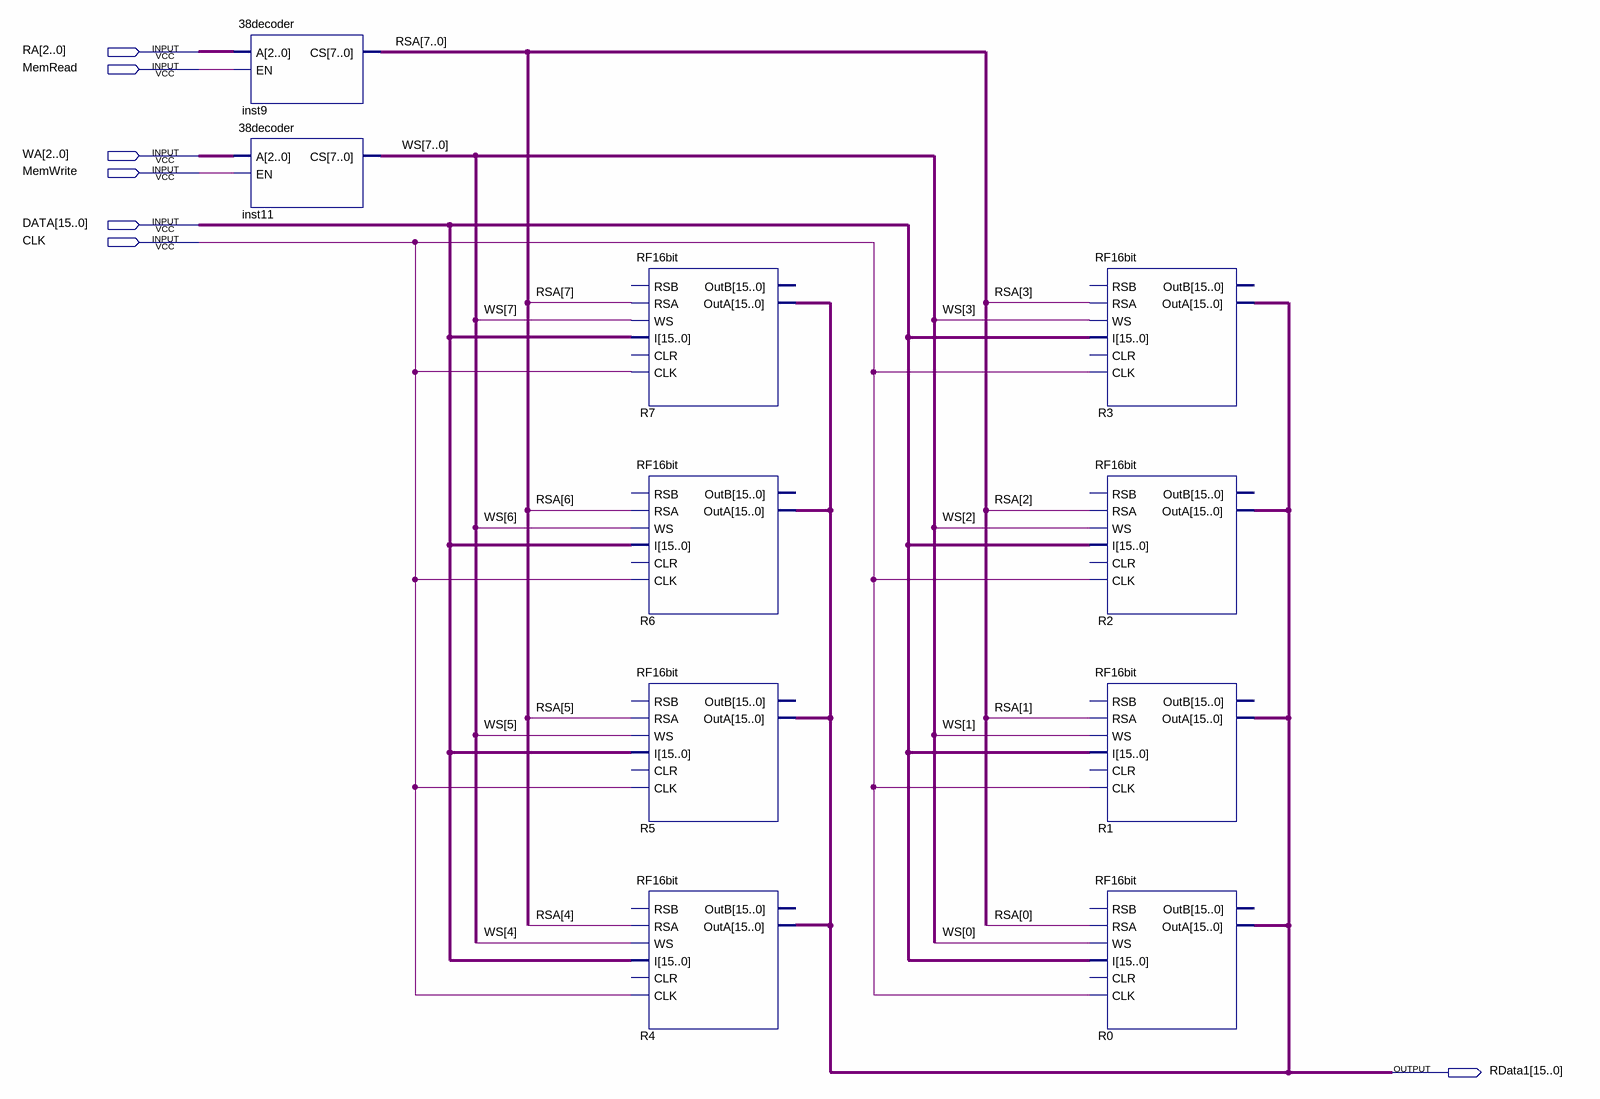
[diagram p0: schematic sheet]
// Quartus schematic DMEM.bdf as structural Verilog: 10 symbols, 7 pins
module DMEM (
  input  [2:0] RA,
  input  MemRead,
  input  [2:0] WA,
  input  MemWrite,
  input  [15:0] DATA,
  input  CLK,
  output [15:0] RData1
);

  wire [7:0] RSA, WS;

  \38decoder  inst9 (.A(RA), .EN(MemRead), .CS(RSA));
  \38decoder  inst11 (.A(WA), .EN(MemWrite), .CS(WS));
  RF16bit R7 (.RSA(RSA[7]), .WS(WS[7]), .I(DATA), .CLK(CLK), .OutA(RData1));  // open: RSB, CLR, OutB
  RF16bit R6 (.RSA(RSA[6]), .WS(WS[6]), .I(DATA), .CLK(CLK), .OutA(RData1));  // open: RSB, CLR, OutB
  RF16bit R5 (.RSA(RSA[5]), .WS(WS[5]), .I(DATA), .CLK(CLK), .OutA(RData1));  // open: RSB, CLR, OutB
  RF16bit R4 (.RSA(RSA[4]), .WS(WS[4]), .I(DATA), .CLK(CLK), .OutA(RData1));  // open: RSB, CLR, OutB
  RF16bit R3 (.RSA(RSA[3]), .WS(WS[3]), .I(DATA), .CLK(CLK), .OutA(RData1));  // open: RSB, CLR, OutB
  RF16bit R2 (.RSA(RSA[2]), .WS(WS[2]), .I(DATA), .CLK(CLK), .OutA(RData1));  // open: RSB, CLR, OutB
  RF16bit R1 (.RSA(RSA[1]), .WS(WS[1]), .I(DATA), .CLK(CLK), .OutA(RData1));  // open: RSB, CLR, OutB
  RF16bit R0 (.RSA(RSA[0]), .WS(WS[0]), .I(DATA), .CLK(CLK), .OutA(RData1));  // open: RSB, CLR, OutB
endmodule
